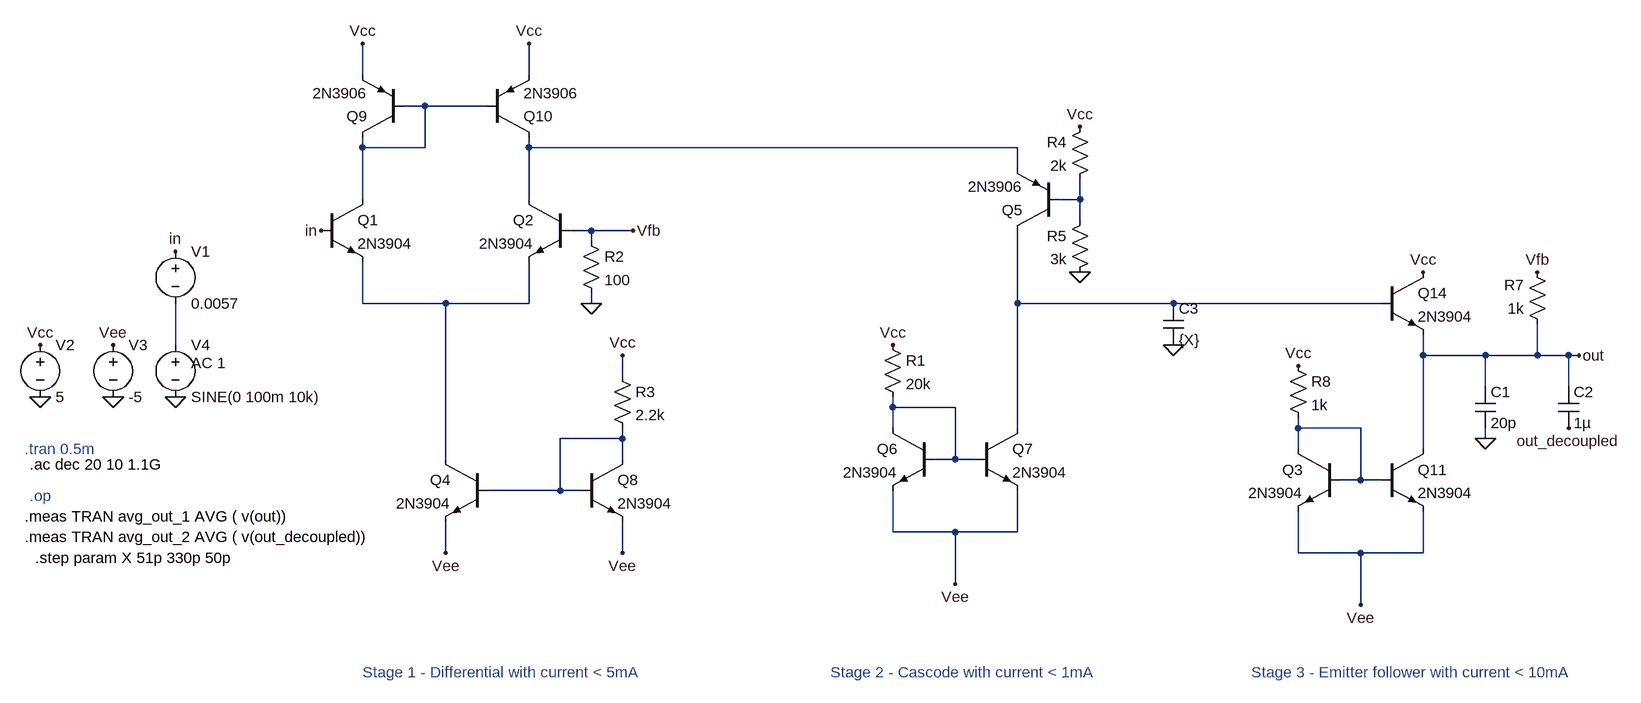
[diagram p0: schematic task2.asc]
task2.asc, the LTspice schematic file:
Version 4
SHEET 1 1416 680
WIRE -800 -688 -800 -736
WIRE -544 -688 -544 -736
WIRE -704 -640 -736 -640
WIRE -608 -640 -704 -640
WIRE -800 -576 -800 -592
WIRE -704 -576 -704 -640
WIRE -704 -576 -800 -576
WIRE -544 -576 -544 -592
WIRE 208 -576 -544 -576
WIRE 208 -544 208 -576
WIRE -800 -496 -800 -576
WIRE -544 -496 -544 -576
WIRE 304 -496 304 -528
WIRE 304 -496 272 -496
WIRE 304 -464 304 -496
WIRE -448 -448 -480 -448
WIRE -384 -448 -448 -448
WIRE -448 -432 -448 -448
WIRE -800 -336 -800 -400
WIRE -672 -336 -800 -336
WIRE -544 -336 -544 -400
WIRE -544 -336 -672 -336
WIRE -448 -336 -448 -352
WIRE 208 -336 208 -448
WIRE 448 -336 208 -336
WIRE 768 -336 448 -336
WIRE -1088 -272 -1088 -336
WIRE 832 -256 832 -288
WIRE 928 -256 832 -256
WIRE 1008 -256 1008 -304
WIRE 1008 -256 928 -256
WIRE 1056 -256 1008 -256
WIRE 1072 -256 1056 -256
WIRE -400 -224 -400 -256
WIRE 928 -208 928 -256
WIRE 1056 -208 1056 -256
WIRE 16 -176 16 -192
WIRE 112 -176 16 -176
WIRE 16 -144 16 -176
WIRE 208 -144 208 -336
WIRE 640 -144 640 -160
WIRE 736 -144 640 -144
WIRE -400 -128 -400 -144
WIRE -400 -128 -496 -128
WIRE 928 -128 928 -144
WIRE 640 -112 640 -144
WIRE 832 -112 832 -256
WIRE -672 -96 -672 -336
WIRE -400 -96 -400 -128
WIRE 112 -96 112 -176
WIRE 112 -96 80 -96
WIRE 144 -96 112 -96
WIRE 736 -64 736 -144
WIRE 736 -64 704 -64
WIRE 768 -64 736 -64
WIRE -496 -48 -496 -128
WIRE -496 -48 -608 -48
WIRE -464 -48 -496 -48
WIRE 16 16 16 -48
WIRE 112 16 16 16
WIRE 208 16 208 -48
WIRE 208 16 112 16
WIRE -672 48 -672 0
WIRE -400 48 -400 0
WIRE 640 48 640 -16
WIRE 736 48 640 48
WIRE 832 48 832 -16
WIRE 832 48 736 48
WIRE 112 96 112 16
WIRE 736 128 736 48
FLAG -1296 -192 0
FLAG -1296 -272 Vcc
FLAG -1184 -192 0
FLAG -1184 -272 Vee
FLAG -1088 -192 0
FLAG -672 48 Vee
FLAG -864 -448 in
FLAG 1072 -256 out
FLAG -400 48 Vee
FLAG -400 -256 Vcc
FLAG -800 -736 Vcc
FLAG -544 -736 Vcc
FLAG 112 96 Vee
FLAG 304 -384 0
FLAG 304 -608 Vcc
FLAG 832 -384 Vcc
FLAG 16 -272 Vcc
FLAG -448 -336 0
FLAG 736 128 Vee
FLAG 640 -240 Vcc
FLAG 1008 -384 Vfb
FLAG 928 -128 0
FLAG 1056 -144 out_decoupled
FLAG -1088 -416 in
FLAG 448 -272 0
FLAG -384 -448 Vfb
DATAFLAG 640 -272 ""
SYMBOL voltage -1296 -288 R0
WINDOW 123 0 0 Left 0
WINDOW 39 0 0 Left 0
SYMATTR InstName V2
SYMATTR Value 5
SYMBOL npn -864 -496 R0
SYMATTR InstName Q1
SYMATTR Value 2N3904
SYMBOL voltage -1184 -288 R0
WINDOW 123 0 0 Left 0
WINDOW 39 0 0 Left 0
SYMATTR InstName V3
SYMATTR Value -5
SYMBOL voltage -1088 -288 R0
WINDOW 123 24 44 Left 2
WINDOW 39 0 0 Left 0
SYMATTR Value2 AC 1
SYMATTR InstName V4
SYMATTR Value SINE(0 100m 10k)
SYMBOL npn -480 -496 M0
SYMATTR InstName Q2
SYMATTR Value 2N3904
SYMBOL npn -608 -96 M0
SYMATTR InstName Q4
SYMATTR Value 2N3904
SYMBOL pnp 272 -448 R180
SYMATTR InstName Q5
SYMATTR Value 2N3906
SYMBOL npn 80 -144 M0
SYMATTR InstName Q6
SYMATTR Value 2N3904
SYMBOL npn 144 -144 R0
SYMATTR InstName Q7
SYMATTR Value 2N3904
SYMBOL npn -464 -96 R0
SYMATTR InstName Q8
SYMATTR Value 2N3904
SYMBOL res -416 -240 R0
SYMATTR InstName R3
SYMATTR Value 2.2k
SYMBOL pnp -736 -592 R180
SYMATTR InstName Q9
SYMATTR Value 2N3906
SYMBOL pnp -608 -592 M180
SYMATTR InstName Q10
SYMATTR Value 2N3906
SYMBOL res 320 -624 M0
SYMATTR InstName R4
SYMATTR Value 2k
SYMBOL res 320 -480 M0
SYMATTR InstName R5
SYMATTR Value 3k
SYMBOL npn 768 -384 R0
SYMATTR InstName Q14
SYMATTR Value 2N3904
SYMBOL res 0 -288 R0
SYMATTR InstName R1
SYMATTR Value 20k
SYMBOL res -464 -448 R0
SYMATTR InstName R2
SYMATTR Value 100
SYMBOL res 1024 -288 R180
WINDOW 0 36 76 Left 2
WINDOW 3 36 40 Left 2
SYMATTR InstName R7
SYMATTR Value 1k
SYMBOL npn 704 -112 M0
SYMATTR InstName Q3
SYMATTR Value 2N3904
SYMBOL npn 768 -112 R0
SYMATTR InstName Q11
SYMATTR Value 2N3904
SYMBOL res 624 -256 R0
SYMATTR InstName R8
SYMATTR Value 1k
SYMBOL cap 912 -208 R0
SYMATTR InstName C1
SYMATTR Value 20p
SYMBOL cap 1040 -208 R0
SYMATTR InstName C2
SYMATTR Value 1µ
SYMBOL voltage -1088 -432 R0
WINDOW 123 0 0 Left 0
WINDOW 39 0 0 Left 0
SYMATTR InstName V1
SYMATTR Value 0.0057
SYMBOL cap 432 -336 R0
SYMATTR InstName C3
SYMATTR Value {X}
TEXT -1320 -112 Left 2 ;.tran 0.5m
TEXT -1312 -88 Left 2 !.ac dec 20 10 1.1G
TEXT -1312 -40 Left 2 ;.op
TEXT -800 232 Left 2 ;Stage 1 - Differential with current < 5mA
TEXT -80 232 Left 2 ;Stage 2 - Cascode with current < 1mA
TEXT 568 232 Left 2 ;Stage 3 - Emitter follower with current < 10mA
TEXT -1320 -8 Left 2 !.meas TRAN avg_out_1 AVG ( v(out))\n.meas TRAN avg_out_2 AVG ( v(out_decoupled))
TEXT -1304 56 Left 2 !.step param X 51p 330p 50p

The netlist it stands for:
* task2.asc
V2 Vcc 0 5
Q1 N001 in N004 0 2N3904
V3 Vee 0 -5
V4 N006 0 SINE(0 100m 10k) AC 1
Q2 N002 Vfb N004 0 2N3904
Q4 N004 N009 Vee 0 2N3904
Q5 N005 N003 N002 0 2N3906
Q6 N007 N007 Vee 0 2N3904
Q7 N005 N007 Vee 0 2N3904
Q8 N009 N009 Vee 0 2N3904
R3 Vcc N009 2.2k
Q9 N001 N001 Vcc 0 2N3906
Q10 N002 N001 Vcc 0 2N3906
R4 Vcc N003 2k
R5 N003 0 3k
Q14 Vcc N005 out 0 2N3904
R1 Vcc N007 20k
R2 Vfb 0 100
R7 out Vfb 1k
Q3 N008 N008 Vee 0 2N3904
Q11 out N008 Vee 0 2N3904
R8 Vcc N008 1k
C1 out 0 20p
C2 out out_decoupled 1µ
V1 in N006 0.0057
C3 N005 0 {X}
.model NPN NPN
.model PNP PNP
.lib standard.bjt
* .tran 0.5m
.ac dec 20 10 1.1G
* .op
* Stage 1 - Differential with current < 5mA
* Stage 2 - Cascode with current < 1mA
* Stage 3 - Emitter follower with current < 10mA
.meas TRAN avg_out_1 AVG ( v(out))
.meas TRAN avg_out_2 AVG ( v(out_decoupled))
.step param X 51p 330p 50p
.backanno
.end

* Results of the author's LTspice run, read from the files saved beside the schematic
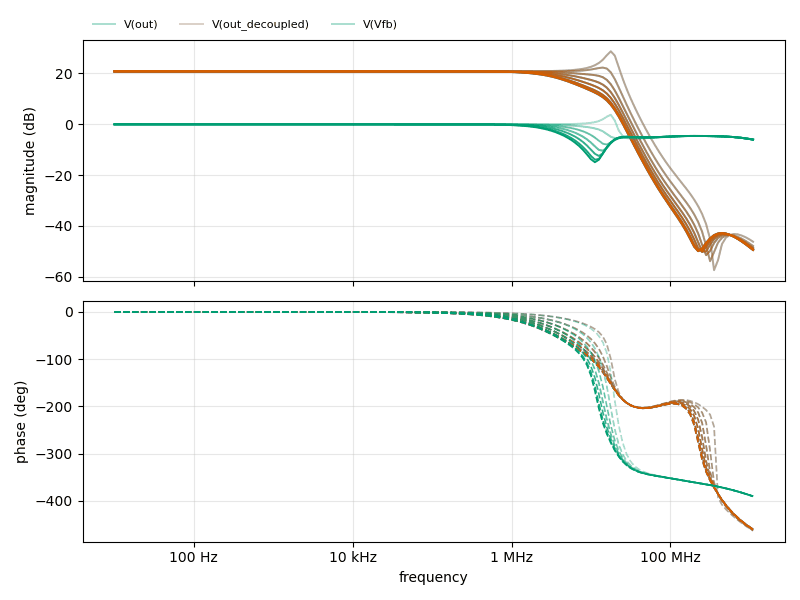
[diagram p1: AC Analysis of task2.asc, plotted from the saved traces]
* AC Analysis, 7 runs:
*   V(out) [x=5.1e-011]: 20.82 dB at 10 Hz, -46.20 dB at 1.1 GHz, peak 28.72 dB at 17.78 MHz, 3 dB below the peak at 14.41 MHz and 20.63 MHz
*   V(out) [x=1.01e-010]: 20.82 dB at 10 Hz, -47.89 dB at 1.1 GHz, peak 22.30 dB at 14.13 MHz, 3 dB below the peak at 18.68 MHz
*   V(out) [x=1.51e-010]: 20.82 dB at 10 Hz, -48.60 dB at 1.1 GHz, peak 20.82 dB at 10 Hz, 3 dB below the peak at 15.26 MHz
*   V(out) [x=2.01e-010]: 20.82 dB at 10 Hz, -48.99 dB at 1.1 GHz, peak 20.82 dB at 10 Hz, 3 dB below the peak at 9.004 MHz
*   V(out) [x=2.51e-010]: 20.82 dB at 10 Hz, -49.23 dB at 1.1 GHz, peak 20.82 dB at 10 Hz, 3 dB below the peak at 6.054 MHz
*   V(out) [x=3.01e-010]: 20.82 dB at 10 Hz, -49.40 dB at 1.1 GHz, peak 20.82 dB at 10 Hz, 3 dB below the peak at 4.676 MHz
*   V(out) [x=3.3e-010]: 20.82 dB at 10 Hz, -49.47 dB at 1.1 GHz, peak 20.82 dB at 10 Hz, 3 dB below the peak at 4.149 MHz
*   V(out_decoupled) [x=5.1e-011]: 20.82 dB at 10 Hz, -46.20 dB at 1.1 GHz, peak 28.72 dB at 17.78 MHz, 3 dB below the peak at 14.41 MHz and 20.63 MHz
*   V(out_decoupled) [x=1.01e-010]: 20.82 dB at 10 Hz, -47.89 dB at 1.1 GHz, peak 22.30 dB at 14.13 MHz, 3 dB below the peak at 18.68 MHz
*   V(out_decoupled) [x=1.51e-010]: 20.82 dB at 10 Hz, -48.60 dB at 1.1 GHz, peak 20.82 dB at 10 Hz, 3 dB below the peak at 15.26 MHz
*   V(out_decoupled) [x=2.01e-010]: 20.82 dB at 10 Hz, -48.99 dB at 1.1 GHz, peak 20.82 dB at 10 Hz, 3 dB below the peak at 9.004 MHz
*   V(out_decoupled) [x=2.51e-010]: 20.82 dB at 10 Hz, -49.23 dB at 1.1 GHz, peak 20.82 dB at 10 Hz, 3 dB below the peak at 6.054 MHz
*   V(out_decoupled) [x=3.01e-010]: 20.82 dB at 10 Hz, -49.40 dB at 1.1 GHz, peak 20.82 dB at 10 Hz, 3 dB below the peak at 4.676 MHz
*   V(out_decoupled) [x=3.3e-010]: 20.82 dB at 10 Hz, -49.47 dB at 1.1 GHz, peak 20.82 dB at 10 Hz, 3 dB below the peak at 4.149 MHz
*   V(Vfb) [x=5.1e-011]: -0.01 dB at 10 Hz, -6.02 dB at 1.1 GHz, peak 3.74 dB at 17.78 MHz, 3 dB below the peak at 10.66 MHz and 20.41 MHz
*   V(Vfb) [x=1.01e-010]: -0.01 dB at 10 Hz, -6.02 dB at 1.1 GHz, peak -0.01 dB at 10 Hz, 3 dB below the peak at 14.53 MHz
*   V(Vfb) [x=1.51e-010]: -0.01 dB at 10 Hz, -6.03 dB at 1.1 GHz, peak -0.01 dB at 10 Hz, 3 dB below the peak at 8.307 MHz
*   V(Vfb) [x=2.01e-010]: -0.01 dB at 10 Hz, -6.03 dB at 1.1 GHz, peak -0.01 dB at 10 Hz, 3 dB below the peak at 5.957 MHz
*   V(Vfb) [x=2.51e-010]: -0.01 dB at 10 Hz, -6.03 dB at 1.1 GHz, peak -0.01 dB at 10 Hz, 3 dB below the peak at 4.681 MHz
*   V(Vfb) [x=3.01e-010]: -0.01 dB at 10 Hz, -6.03 dB at 1.1 GHz, peak -0.01 dB at 10 Hz, 3 dB below the peak at 3.869 MHz
*   V(Vfb) [x=3.3e-010]: -0.01 dB at 10 Hz, -6.03 dB at 1.1 GHz, peak -0.01 dB at 10 Hz, 3 dB below the peak at 3.521 MHz